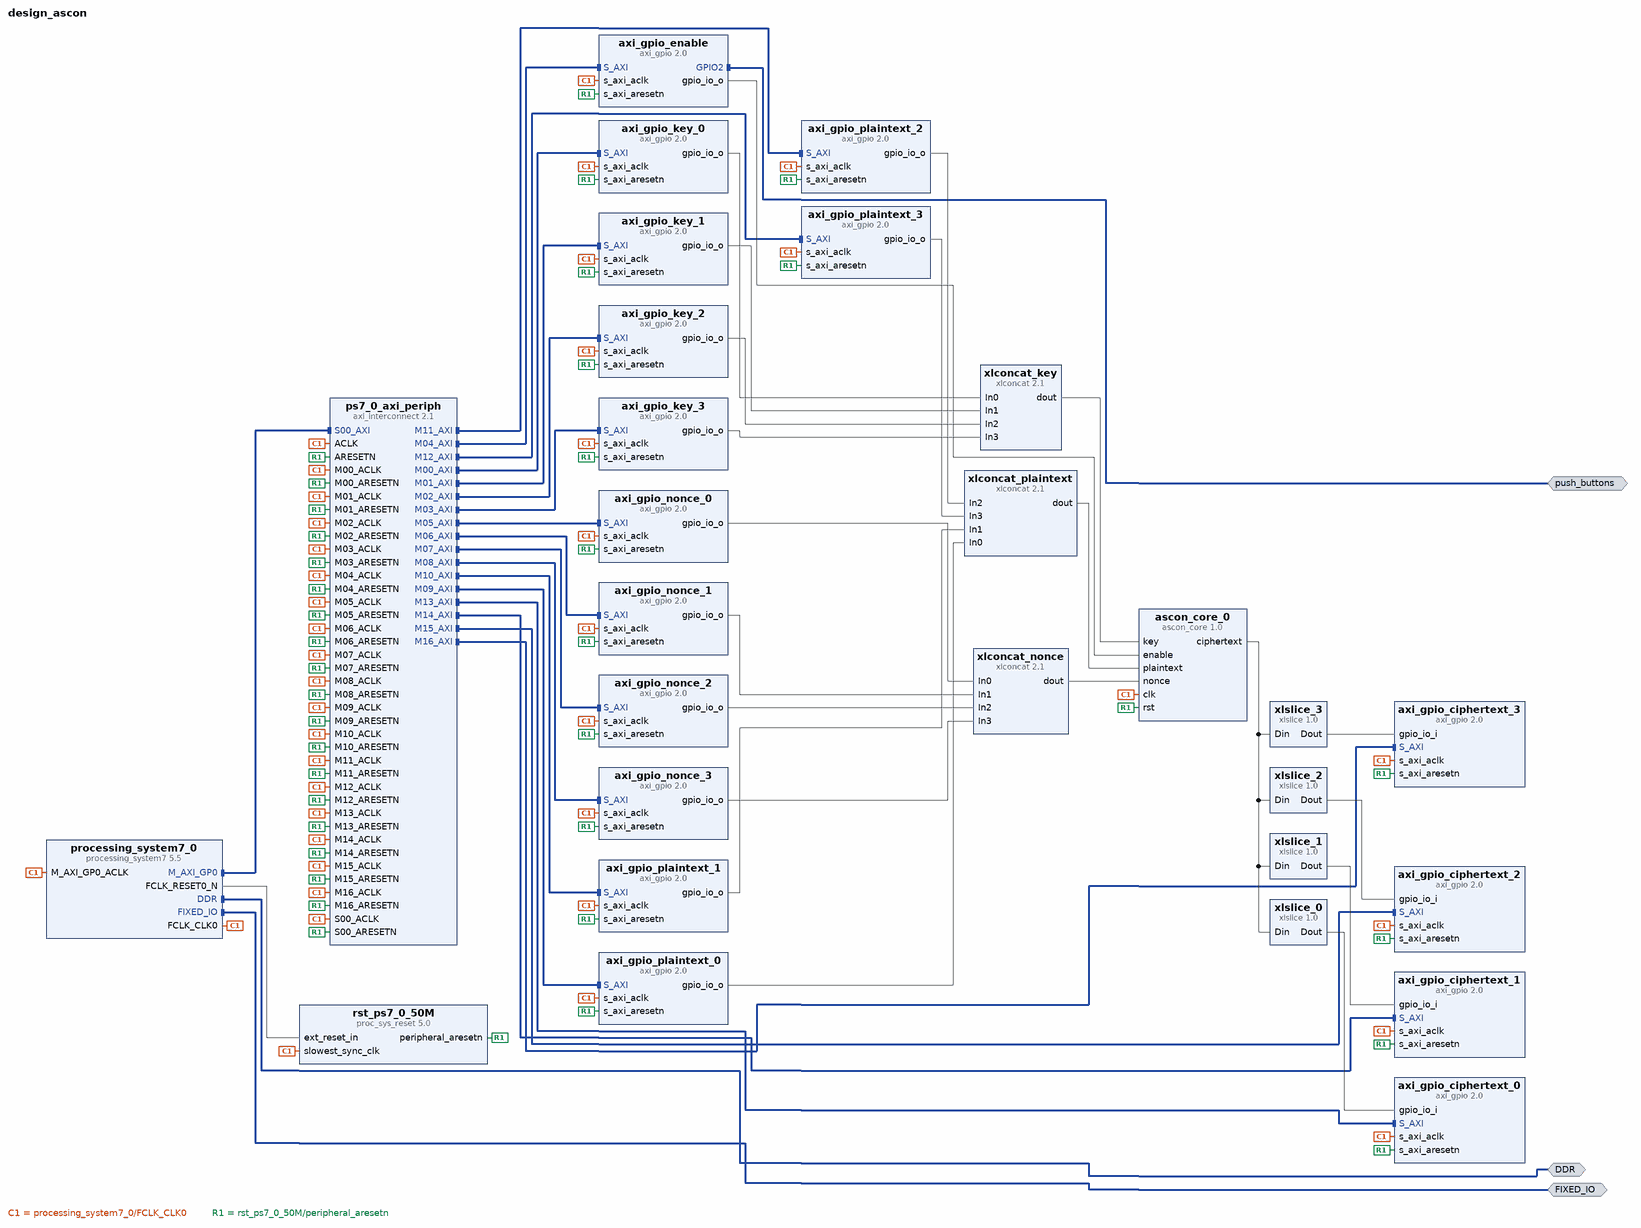
[diagram p0: block diagram of the top level]
# Vivado block design design_ascon, xc7z020clg484-1, Vivado 2023.1
create_bd_design design_ascon

create_bd_intf_port -mode Master -vlnv xilinx.com:interface:ddrx_rtl:1.0 DDR
create_bd_intf_port -mode Master -vlnv xilinx.com:display_processing_system7:fixedio_rtl:1.0 FIXED_IO
create_bd_intf_port -mode Master -vlnv xilinx.com:interface:gpio_rtl:1.0 push_buttons

create_bd_cell -type ip -vlnv xilinx.com:ip:processing_system7:5.5 processing_system7_0
set_property -dict [list \
  CONFIG.PCW_APU_PERIPHERAL_FREQMHZ 666.666666 \
  CONFIG.PCW_CAN0_CAN0_IO {MIO 46 .. 47} \
  CONFIG.PCW_CAN0_PERIPHERAL_ENABLE 1 \
  CONFIG.PCW_CAN_PERIPHERAL_FREQMHZ 23.8095 \
  CONFIG.PCW_ENET0_ENET0_IO {MIO 16 .. 27} \
  CONFIG.PCW_ENET0_GRP_MDIO_ENABLE 1 \
  CONFIG.PCW_ENET0_GRP_MDIO_IO {MIO 52 .. 53} \
  CONFIG.PCW_ENET0_PERIPHERAL_ENABLE 1 \
  CONFIG.PCW_ENET0_PERIPHERAL_FREQMHZ {100 Mbps} \
  CONFIG.PCW_ENET0_RESET_ENABLE 1 \
  CONFIG.PCW_ENET0_RESET_IO {MIO 11} \
  CONFIG.PCW_ENET_RESET_ENABLE 1 \
  CONFIG.PCW_ENET_RESET_SELECT {Share reset pin} \
  CONFIG.PCW_GPIO_MIO_GPIO_ENABLE 1 \
  CONFIG.PCW_GPIO_MIO_GPIO_IO MIO \
  CONFIG.PCW_I2C0_GRP_INT_ENABLE 0 \
  CONFIG.PCW_I2C0_I2C0_IO {MIO 50 .. 51} \
  CONFIG.PCW_I2C0_PERIPHERAL_ENABLE 1 \
  CONFIG.PCW_I2C0_RESET_ENABLE 1 \
  CONFIG.PCW_I2C0_RESET_IO {MIO 13} \
  CONFIG.PCW_I2C_PERIPHERAL_FREQMHZ 111.111115 \
  CONFIG.PCW_I2C_RESET_ENABLE 1 \
  CONFIG.PCW_I2C_RESET_SELECT {Share reset pin} \
  CONFIG.PCW_PRESET_BANK0_VOLTAGE {LVCMOS 1.8V} \
  CONFIG.PCW_PRESET_BANK1_VOLTAGE {LVCMOS 1.8V} \
  CONFIG.PCW_QSPI_GRP_FBCLK_ENABLE 1 \
  CONFIG.PCW_QSPI_GRP_FBCLK_IO {MIO 8} \
  CONFIG.PCW_QSPI_GRP_SINGLE_SS_ENABLE 1 \
  CONFIG.PCW_QSPI_GRP_SINGLE_SS_IO {MIO 1 .. 6} \
  CONFIG.PCW_QSPI_PERIPHERAL_ENABLE 1 \
  CONFIG.PCW_QSPI_QSPI_IO {MIO 1 .. 6} \
  CONFIG.PCW_SD0_GRP_CD_ENABLE 1 \
  CONFIG.PCW_SD0_GRP_CD_IO {MIO 0} \
  CONFIG.PCW_SD0_GRP_WP_ENABLE 1 \
  CONFIG.PCW_SD0_GRP_WP_IO {MIO 15} \
  CONFIG.PCW_SD0_PERIPHERAL_ENABLE 1 \
  CONFIG.PCW_SD0_SD0_IO {MIO 40 .. 45} \
  CONFIG.PCW_SDIO_PERIPHERAL_FREQMHZ 50 \
  CONFIG.PCW_SINGLE_QSPI_DATA_MODE x4 \
  CONFIG.PCW_TTC0_PERIPHERAL_ENABLE 1 \
  CONFIG.PCW_TTC0_TTC0_IO EMIO \
  CONFIG.PCW_UART1_PERIPHERAL_ENABLE 1 \
  CONFIG.PCW_UART1_UART1_IO {MIO 48 .. 49} \
  CONFIG.PCW_UART_PERIPHERAL_FREQMHZ 50 \
  CONFIG.PCW_UIPARAM_DDR_FREQ_MHZ 533.333333 \
  CONFIG.PCW_UIPARAM_DDR_PARTNO {MT41J256M8 HX-15E} \
  CONFIG.PCW_USB0_PERIPHERAL_ENABLE 1 \
  CONFIG.PCW_USB0_RESET_ENABLE 1 \
  CONFIG.PCW_USB0_RESET_IO {MIO 7} \
  CONFIG.PCW_USB0_USB0_IO {MIO 28 .. 39} \
  CONFIG.PCW_USB_RESET_ENABLE 1 \
  CONFIG.PCW_USB_RESET_SELECT {Share reset pin} \
  CONFIG.preset ZC702 \
] [get_bd_cells processing_system7_0]
# 222 more settings of processing_system7_0 are not shown: defaults, MIO pin electricals, DDR timing, and values the tool derives
create_bd_cell -type ip -vlnv xilinx.com:ip:proc_sys_reset:5.0 rst_ps7_0_50M
create_bd_cell -type ip -vlnv xilinx.com:ip:xlconcat:2.1 xlconcat_key
set_property -dict [list \
  CONFIG.IN0_WIDTH 32 \
  CONFIG.IN1_WIDTH 32 \
  CONFIG.IN2_WIDTH 32 \
  CONFIG.IN3_WIDTH 32 \
  CONFIG.NUM_PORTS 4 \
] [get_bd_cells xlconcat_key]
create_bd_cell -type ip -vlnv xilinx.com:ip:xlconcat:2.1 xlconcat_nonce
set_property -dict [list \
  CONFIG.IN0_WIDTH 32 \
  CONFIG.IN1_WIDTH 32 \
  CONFIG.IN2_WIDTH 32 \
  CONFIG.IN3_WIDTH 32 \
  CONFIG.NUM_PORTS 4 \
] [get_bd_cells xlconcat_nonce]
create_bd_cell -type ip -vlnv xilinx.com:ip:xlconcat:2.1 xlconcat_plaintext
set_property -dict [list \
  CONFIG.IN0_WIDTH 32 \
  CONFIG.IN1_WIDTH 32 \
  CONFIG.IN2_WIDTH 32 \
  CONFIG.IN3_WIDTH 32 \
  CONFIG.NUM_PORTS 4 \
] [get_bd_cells xlconcat_plaintext]
create_bd_cell -type ip -vlnv xilinx.com:ip:xlslice:1.0 xlslice_0
set_property -dict {CONFIG.DIN_FROM 127 CONFIG.DIN_TO 96 CONFIG.DIN_WIDTH 128} [get_bd_cells xlslice_0]
create_bd_cell -type ip -vlnv xilinx.com:ip:xlslice:1.0 xlslice_1
set_property -dict {CONFIG.DIN_FROM 95 CONFIG.DIN_TO 64 CONFIG.DIN_WIDTH 128} [get_bd_cells xlslice_1]
create_bd_cell -type ip -vlnv xilinx.com:ip:xlslice:1.0 xlslice_2
set_property -dict {CONFIG.DIN_FROM 63 CONFIG.DIN_TO 32 CONFIG.DIN_WIDTH 128} [get_bd_cells xlslice_2]
create_bd_cell -type ip -vlnv xilinx.com:ip:xlslice:1.0 xlslice_3
set_property -dict {CONFIG.DIN_FROM 31 CONFIG.DIN_TO 0 CONFIG.DIN_WIDTH 128} [get_bd_cells xlslice_3]
create_bd_cell -type ip -vlnv xilinx.com:ip:axi_gpio:2.0 axi_gpio_key_0
set_property -dict {CONFIG.C_ALL_INPUTS 0 CONFIG.C_ALL_OUTPUTS 1} [get_bd_cells axi_gpio_key_0]
create_bd_cell -type ip -vlnv xilinx.com:ip:axi_gpio:2.0 axi_gpio_key_1
set_property -dict {CONFIG.C_ALL_INPUTS 0 CONFIG.C_ALL_OUTPUTS 1} [get_bd_cells axi_gpio_key_1]
create_bd_cell -type ip -vlnv xilinx.com:ip:axi_gpio:2.0 axi_gpio_key_2
set_property -dict {CONFIG.C_ALL_INPUTS 0 CONFIG.C_ALL_OUTPUTS 1} [get_bd_cells axi_gpio_key_2]
create_bd_cell -type ip -vlnv xilinx.com:ip:axi_gpio:2.0 axi_gpio_key_3
set_property -dict {CONFIG.C_ALL_INPUTS 0 CONFIG.C_ALL_OUTPUTS 1} [get_bd_cells axi_gpio_key_3]
create_bd_cell -type ip -vlnv xilinx.com:ip:axi_gpio:2.0 axi_gpio_ciphertext_0
set_property -dict {CONFIG.C_ALL_INPUTS 1} [get_bd_cells axi_gpio_ciphertext_0]
create_bd_cell -type ip -vlnv xilinx.com:ip:axi_gpio:2.0 axi_gpio_ciphertext_1
set_property -dict {CONFIG.C_ALL_INPUTS 1} [get_bd_cells axi_gpio_ciphertext_1]
create_bd_cell -type ip -vlnv xilinx.com:ip:axi_gpio:2.0 axi_gpio_ciphertext_2
set_property -dict {CONFIG.C_ALL_INPUTS 1} [get_bd_cells axi_gpio_ciphertext_2]
create_bd_cell -type ip -vlnv xilinx.com:ip:axi_gpio:2.0 axi_gpio_ciphertext_3
set_property -dict {CONFIG.C_ALL_INPUTS 1} [get_bd_cells axi_gpio_ciphertext_3]
create_bd_cell -type ip -vlnv xilinx.com:ip:axi_gpio:2.0 axi_gpio_nonce_0
set_property -dict {CONFIG.C_ALL_INPUTS 0 CONFIG.C_ALL_OUTPUTS 1} [get_bd_cells axi_gpio_nonce_0]
create_bd_cell -type ip -vlnv xilinx.com:ip:axi_gpio:2.0 axi_gpio_nonce_1
set_property -dict {CONFIG.C_ALL_INPUTS 0 CONFIG.C_ALL_OUTPUTS 1} [get_bd_cells axi_gpio_nonce_1]
create_bd_cell -type ip -vlnv xilinx.com:ip:axi_gpio:2.0 axi_gpio_nonce_2
set_property -dict {CONFIG.C_ALL_INPUTS 0 CONFIG.C_ALL_OUTPUTS 1} [get_bd_cells axi_gpio_nonce_2]
create_bd_cell -type ip -vlnv xilinx.com:ip:axi_gpio:2.0 axi_gpio_nonce_3
set_property -dict {CONFIG.C_ALL_INPUTS 0 CONFIG.C_ALL_OUTPUTS 1} [get_bd_cells axi_gpio_nonce_3]
create_bd_cell -type ip -vlnv xilinx.com:ip:axi_gpio:2.0 axi_gpio_enable
set_property -dict [list \
  CONFIG.C_ALL_INPUTS 0 \
  CONFIG.C_ALL_OUTPUTS 1 \
  CONFIG.C_GPIO_WIDTH 1 \
  CONFIG.GPIO2_BOARD_INTERFACE push_buttons \
  CONFIG.USE_BOARD_FLOW true \
] [get_bd_cells axi_gpio_enable]
create_bd_cell -type ip -vlnv xilinx.com:ip:axi_gpio:2.0 axi_gpio_plaintext_0
set_property -dict {CONFIG.C_ALL_INPUTS 0 CONFIG.C_ALL_OUTPUTS 1} [get_bd_cells axi_gpio_plaintext_0]
create_bd_cell -type ip -vlnv xilinx.com:ip:axi_gpio:2.0 axi_gpio_plaintext_1
set_property -dict {CONFIG.C_ALL_INPUTS 0 CONFIG.C_ALL_OUTPUTS 1} [get_bd_cells axi_gpio_plaintext_1]
create_bd_cell -type ip -vlnv xilinx.com:ip:axi_gpio:2.0 axi_gpio_plaintext_2
set_property -dict {CONFIG.C_ALL_INPUTS 0 CONFIG.C_ALL_OUTPUTS 1} [get_bd_cells axi_gpio_plaintext_2]
create_bd_cell -type ip -vlnv xilinx.com:ip:axi_gpio:2.0 axi_gpio_plaintext_3
set_property -dict {CONFIG.C_ALL_INPUTS 0 CONFIG.C_ALL_OUTPUTS 1} [get_bd_cells axi_gpio_plaintext_3]
create_bd_cell -type ip -vlnv xilinx.com:ip:axi_interconnect:2.1 ps7_0_axi_periph
set_property -dict {CONFIG.NUM_MI 17} [get_bd_cells ps7_0_axi_periph]
create_bd_cell -type ip -vlnv xilinx.com:user:ascon_core:1.0 ascon_core_0

# ---- connections ----

connect_bd_intf_net [get_bd_intf_ports push_buttons] [get_bd_intf_pins axi_gpio_enable/GPIO2]
connect_bd_intf_net [get_bd_intf_ports DDR] [get_bd_intf_pins processing_system7_0/DDR]
connect_bd_intf_net [get_bd_intf_ports FIXED_IO] [get_bd_intf_pins processing_system7_0/FIXED_IO]
connect_bd_intf_net [get_bd_intf_pins processing_system7_0/M_AXI_GP0] [get_bd_intf_pins ps7_0_axi_periph/S00_AXI]
connect_bd_intf_net [get_bd_intf_pins ps7_0_axi_periph/M00_AXI] [get_bd_intf_pins axi_gpio_key_0/S_AXI]
connect_bd_intf_net [get_bd_intf_pins ps7_0_axi_periph/M01_AXI] [get_bd_intf_pins axi_gpio_key_1/S_AXI]
connect_bd_intf_net [get_bd_intf_pins ps7_0_axi_periph/M02_AXI] [get_bd_intf_pins axi_gpio_key_2/S_AXI]
connect_bd_intf_net [get_bd_intf_pins ps7_0_axi_periph/M03_AXI] [get_bd_intf_pins axi_gpio_key_3/S_AXI]
connect_bd_intf_net [get_bd_intf_pins ps7_0_axi_periph/M04_AXI] [get_bd_intf_pins axi_gpio_enable/S_AXI]
connect_bd_intf_net [get_bd_intf_pins ps7_0_axi_periph/M05_AXI] [get_bd_intf_pins axi_gpio_nonce_0/S_AXI]
connect_bd_intf_net [get_bd_intf_pins ps7_0_axi_periph/M06_AXI] [get_bd_intf_pins axi_gpio_nonce_1/S_AXI]
connect_bd_intf_net [get_bd_intf_pins ps7_0_axi_periph/M07_AXI] [get_bd_intf_pins axi_gpio_nonce_2/S_AXI]
connect_bd_intf_net [get_bd_intf_pins ps7_0_axi_periph/M08_AXI] [get_bd_intf_pins axi_gpio_nonce_3/S_AXI]
connect_bd_intf_net [get_bd_intf_pins ps7_0_axi_periph/M09_AXI] [get_bd_intf_pins axi_gpio_plaintext_0/S_AXI]
connect_bd_intf_net [get_bd_intf_pins ps7_0_axi_periph/M10_AXI] [get_bd_intf_pins axi_gpio_plaintext_1/S_AXI]
connect_bd_intf_net [get_bd_intf_pins ps7_0_axi_periph/M11_AXI] [get_bd_intf_pins axi_gpio_plaintext_2/S_AXI]
connect_bd_intf_net [get_bd_intf_pins ps7_0_axi_periph/M12_AXI] [get_bd_intf_pins axi_gpio_plaintext_3/S_AXI]
connect_bd_intf_net [get_bd_intf_pins ps7_0_axi_periph/M13_AXI] [get_bd_intf_pins axi_gpio_ciphertext_0/S_AXI]
connect_bd_intf_net [get_bd_intf_pins ps7_0_axi_periph/M14_AXI] [get_bd_intf_pins axi_gpio_ciphertext_1/S_AXI]
connect_bd_intf_net [get_bd_intf_pins ps7_0_axi_periph/M15_AXI] [get_bd_intf_pins axi_gpio_ciphertext_2/S_AXI]
connect_bd_intf_net [get_bd_intf_pins ps7_0_axi_periph/M16_AXI] [get_bd_intf_pins axi_gpio_ciphertext_3/S_AXI]
connect_bd_net [get_bd_pins ascon_core_0/ciphertext] \
  [get_bd_pins xlslice_0/Din] [get_bd_pins xlslice_1/Din] [get_bd_pins xlslice_2/Din] [get_bd_pins xlslice_3/Din]
connect_bd_net -net axi_gpio_0_gpio_io_o [get_bd_pins axi_gpio_key_0/gpio_io_o] [get_bd_pins xlconcat_key/In0]
connect_bd_net -net axi_gpio_10_gpio_io_o [get_bd_pins axi_gpio_plaintext_1/gpio_io_o] [get_bd_pins xlconcat_plaintext/In1]
connect_bd_net -net axi_gpio_11_gpio_io_o [get_bd_pins axi_gpio_plaintext_2/gpio_io_o] [get_bd_pins xlconcat_plaintext/In2]
connect_bd_net -net axi_gpio_12_gpio_io_o [get_bd_pins axi_gpio_plaintext_3/gpio_io_o] [get_bd_pins xlconcat_plaintext/In3]
connect_bd_net -net axi_gpio_1_gpio_io_o [get_bd_pins axi_gpio_key_1/gpio_io_o] [get_bd_pins xlconcat_key/In1]
connect_bd_net -net axi_gpio_2_gpio_io_o [get_bd_pins axi_gpio_key_2/gpio_io_o] [get_bd_pins xlconcat_key/In2]
connect_bd_net -net axi_gpio_3_gpio_io_o [get_bd_pins axi_gpio_key_3/gpio_io_o] [get_bd_pins xlconcat_key/In3]
connect_bd_net -net axi_gpio_4_gpio_io_o [get_bd_pins axi_gpio_enable/gpio_io_o] [get_bd_pins ascon_core_0/enable]
connect_bd_net -net axi_gpio_5_gpio_io_o [get_bd_pins axi_gpio_nonce_0/gpio_io_o] [get_bd_pins xlconcat_nonce/In0]
connect_bd_net -net axi_gpio_6_gpio_io_o [get_bd_pins axi_gpio_nonce_1/gpio_io_o] [get_bd_pins xlconcat_nonce/In1]
connect_bd_net -net axi_gpio_7_gpio_io_o [get_bd_pins axi_gpio_nonce_2/gpio_io_o] [get_bd_pins xlconcat_nonce/In2]
connect_bd_net -net axi_gpio_8_gpio_io_o [get_bd_pins axi_gpio_nonce_3/gpio_io_o] [get_bd_pins xlconcat_nonce/In3]
connect_bd_net -net axi_gpio_9_gpio_io_o [get_bd_pins axi_gpio_plaintext_0/gpio_io_o] [get_bd_pins xlconcat_plaintext/In0]
connect_bd_net [get_bd_pins processing_system7_0/FCLK_CLK0] \
  [get_bd_pins rst_ps7_0_50M/slowest_sync_clk] [get_bd_pins processing_system7_0/M_AXI_GP0_ACLK] \
  [get_bd_pins axi_gpio_key_0/s_axi_aclk] [get_bd_pins axi_gpio_key_1/s_axi_aclk] [get_bd_pins axi_gpio_key_2/s_axi_aclk] \
  [get_bd_pins axi_gpio_key_3/s_axi_aclk] [get_bd_pins axi_gpio_ciphertext_0/s_axi_aclk] \
  [get_bd_pins axi_gpio_ciphertext_1/s_axi_aclk] [get_bd_pins axi_gpio_ciphertext_2/s_axi_aclk] \
  [get_bd_pins axi_gpio_ciphertext_3/s_axi_aclk] [get_bd_pins axi_gpio_nonce_0/s_axi_aclk] \
  [get_bd_pins axi_gpio_nonce_1/s_axi_aclk] [get_bd_pins axi_gpio_nonce_2/s_axi_aclk] \
  [get_bd_pins axi_gpio_nonce_3/s_axi_aclk] [get_bd_pins axi_gpio_enable/s_axi_aclk] \
  [get_bd_pins axi_gpio_plaintext_0/s_axi_aclk] [get_bd_pins axi_gpio_plaintext_1/s_axi_aclk] \
  [get_bd_pins axi_gpio_plaintext_2/s_axi_aclk] [get_bd_pins axi_gpio_plaintext_3/s_axi_aclk] \
  [get_bd_pins ps7_0_axi_periph/ACLK] [get_bd_pins ps7_0_axi_periph/S00_ACLK] [get_bd_pins ps7_0_axi_periph/M00_ACLK] \
  [get_bd_pins ps7_0_axi_periph/M01_ACLK] [get_bd_pins ps7_0_axi_periph/M02_ACLK] [get_bd_pins ps7_0_axi_periph/M03_ACLK] \
  [get_bd_pins ps7_0_axi_periph/M04_ACLK] [get_bd_pins ps7_0_axi_periph/M05_ACLK] [get_bd_pins ps7_0_axi_periph/M06_ACLK] \
  [get_bd_pins ps7_0_axi_periph/M07_ACLK] [get_bd_pins ps7_0_axi_periph/M08_ACLK] [get_bd_pins ps7_0_axi_periph/M09_ACLK] \
  [get_bd_pins ps7_0_axi_periph/M10_ACLK] [get_bd_pins ps7_0_axi_periph/M11_ACLK] [get_bd_pins ps7_0_axi_periph/M12_ACLK] \
  [get_bd_pins ps7_0_axi_periph/M13_ACLK] [get_bd_pins ps7_0_axi_periph/M14_ACLK] [get_bd_pins ps7_0_axi_periph/M15_ACLK] \
  [get_bd_pins ps7_0_axi_periph/M16_ACLK] [get_bd_pins ascon_core_0/clk]
connect_bd_net [get_bd_pins processing_system7_0/FCLK_RESET0_N] [get_bd_pins rst_ps7_0_50M/ext_reset_in]
connect_bd_net [get_bd_pins rst_ps7_0_50M/peripheral_aresetn] \
  [get_bd_pins axi_gpio_key_0/s_axi_aresetn] [get_bd_pins axi_gpio_key_1/s_axi_aresetn] \
  [get_bd_pins axi_gpio_key_2/s_axi_aresetn] [get_bd_pins axi_gpio_key_3/s_axi_aresetn] \
  [get_bd_pins axi_gpio_ciphertext_0/s_axi_aresetn] [get_bd_pins axi_gpio_ciphertext_1/s_axi_aresetn] \
  [get_bd_pins axi_gpio_ciphertext_2/s_axi_aresetn] [get_bd_pins axi_gpio_ciphertext_3/s_axi_aresetn] \
  [get_bd_pins axi_gpio_nonce_0/s_axi_aresetn] [get_bd_pins axi_gpio_nonce_1/s_axi_aresetn] \
  [get_bd_pins axi_gpio_nonce_2/s_axi_aresetn] [get_bd_pins axi_gpio_nonce_3/s_axi_aresetn] \
  [get_bd_pins axi_gpio_enable/s_axi_aresetn] [get_bd_pins axi_gpio_plaintext_0/s_axi_aresetn] \
  [get_bd_pins axi_gpio_plaintext_1/s_axi_aresetn] [get_bd_pins axi_gpio_plaintext_2/s_axi_aresetn] \
  [get_bd_pins axi_gpio_plaintext_3/s_axi_aresetn] [get_bd_pins ps7_0_axi_periph/ARESETN] \
  [get_bd_pins ps7_0_axi_periph/S00_ARESETN] [get_bd_pins ps7_0_axi_periph/M00_ARESETN] \
  [get_bd_pins ps7_0_axi_periph/M01_ARESETN] [get_bd_pins ps7_0_axi_periph/M02_ARESETN] \
  [get_bd_pins ps7_0_axi_periph/M03_ARESETN] [get_bd_pins ps7_0_axi_periph/M04_ARESETN] \
  [get_bd_pins ps7_0_axi_periph/M05_ARESETN] [get_bd_pins ps7_0_axi_periph/M06_ARESETN] \
  [get_bd_pins ps7_0_axi_periph/M07_ARESETN] [get_bd_pins ps7_0_axi_periph/M08_ARESETN] \
  [get_bd_pins ps7_0_axi_periph/M09_ARESETN] [get_bd_pins ps7_0_axi_periph/M10_ARESETN] \
  [get_bd_pins ps7_0_axi_periph/M11_ARESETN] [get_bd_pins ps7_0_axi_periph/M12_ARESETN] \
  [get_bd_pins ps7_0_axi_periph/M13_ARESETN] [get_bd_pins ps7_0_axi_periph/M14_ARESETN] \
  [get_bd_pins ps7_0_axi_periph/M15_ARESETN] [get_bd_pins ps7_0_axi_periph/M16_ARESETN] [get_bd_pins ascon_core_0/rst]
connect_bd_net -net xlconcat_0_dout [get_bd_pins xlconcat_key/dout] [get_bd_pins ascon_core_0/key]
connect_bd_net -net xlconcat_1_dout [get_bd_pins xlconcat_nonce/dout] [get_bd_pins ascon_core_0/nonce]
connect_bd_net -net xlconcat_2_dout [get_bd_pins xlconcat_plaintext/dout] [get_bd_pins ascon_core_0/plaintext]
connect_bd_net [get_bd_pins xlslice_0/Dout] [get_bd_pins axi_gpio_ciphertext_0/gpio_io_i]
connect_bd_net [get_bd_pins xlslice_1/Dout] [get_bd_pins axi_gpio_ciphertext_1/gpio_io_i]
connect_bd_net [get_bd_pins xlslice_2/Dout] [get_bd_pins axi_gpio_ciphertext_2/gpio_io_i]
connect_bd_net [get_bd_pins xlslice_3/Dout] [get_bd_pins axi_gpio_ciphertext_3/gpio_io_i]

# ---- address map ----
assign_bd_address -offset 0x41200000 -range 64K -target_address_space [get_bd_addr_spaces processing_system7_0/Data] [get_bd_addr_segs axi_gpio_key_0/S_AXI/Reg]
assign_bd_address -offset 0x41210000 -range 64K -target_address_space [get_bd_addr_spaces processing_system7_0/Data] [get_bd_addr_segs axi_gpio_key_1/S_AXI/Reg]
assign_bd_address -offset 0x41220000 -range 64K -target_address_space [get_bd_addr_spaces processing_system7_0/Data] [get_bd_addr_segs axi_gpio_key_2/S_AXI/Reg]
assign_bd_address -offset 0x41230000 -range 64K -target_address_space [get_bd_addr_spaces processing_system7_0/Data] [get_bd_addr_segs axi_gpio_key_3/S_AXI/Reg]
assign_bd_address -offset 0x41240000 -range 64K -target_address_space [get_bd_addr_spaces processing_system7_0/Data] [get_bd_addr_segs axi_gpio_enable/S_AXI/Reg]
assign_bd_address -offset 0x41250000 -range 64K -target_address_space [get_bd_addr_spaces processing_system7_0/Data] [get_bd_addr_segs axi_gpio_nonce_0/S_AXI/Reg]
assign_bd_address -offset 0x41260000 -range 64K -target_address_space [get_bd_addr_spaces processing_system7_0/Data] [get_bd_addr_segs axi_gpio_nonce_1/S_AXI/Reg]
assign_bd_address -offset 0x41270000 -range 64K -target_address_space [get_bd_addr_spaces processing_system7_0/Data] [get_bd_addr_segs axi_gpio_nonce_2/S_AXI/Reg]
assign_bd_address -offset 0x41280000 -range 64K -target_address_space [get_bd_addr_spaces processing_system7_0/Data] [get_bd_addr_segs axi_gpio_nonce_3/S_AXI/Reg]
assign_bd_address -offset 0x41290000 -range 64K -target_address_space [get_bd_addr_spaces processing_system7_0/Data] [get_bd_addr_segs axi_gpio_plaintext_0/S_AXI/Reg]
assign_bd_address -offset 0x412A0000 -range 64K -target_address_space [get_bd_addr_spaces processing_system7_0/Data] [get_bd_addr_segs axi_gpio_plaintext_1/S_AXI/Reg]
assign_bd_address -offset 0x412B0000 -range 64K -target_address_space [get_bd_addr_spaces processing_system7_0/Data] [get_bd_addr_segs axi_gpio_plaintext_2/S_AXI/Reg]
assign_bd_address -offset 0x412C0000 -range 64K -target_address_space [get_bd_addr_spaces processing_system7_0/Data] [get_bd_addr_segs axi_gpio_plaintext_3/S_AXI/Reg]
assign_bd_address -offset 0x412D0000 -range 64K -target_address_space [get_bd_addr_spaces processing_system7_0/Data] [get_bd_addr_segs axi_gpio_ciphertext_0/S_AXI/Reg]
assign_bd_address -offset 0x412E0000 -range 64K -target_address_space [get_bd_addr_spaces processing_system7_0/Data] [get_bd_addr_segs axi_gpio_ciphertext_1/S_AXI/Reg]
assign_bd_address -offset 0x412F0000 -range 64K -target_address_space [get_bd_addr_spaces processing_system7_0/Data] [get_bd_addr_segs axi_gpio_ciphertext_2/S_AXI/Reg]
assign_bd_address -offset 0x41300000 -range 64K -target_address_space [get_bd_addr_spaces processing_system7_0/Data] [get_bd_addr_segs axi_gpio_ciphertext_3/S_AXI/Reg]

validate_bd_design
save_bd_design
